# EasyEDA Pro project ProPrj_主板-智能视觉_2026-04-06.epro

# Schematic Schematic1
Board Name: Board1; Create Date: 2026-01-07; Page Name: P1; Project Name: 主板-智能视觉; Schematic Name: Schematic1; Update Date: 2026-03-23; Company: 嘉立创EDA; Page Size: A4; Version: V1.0
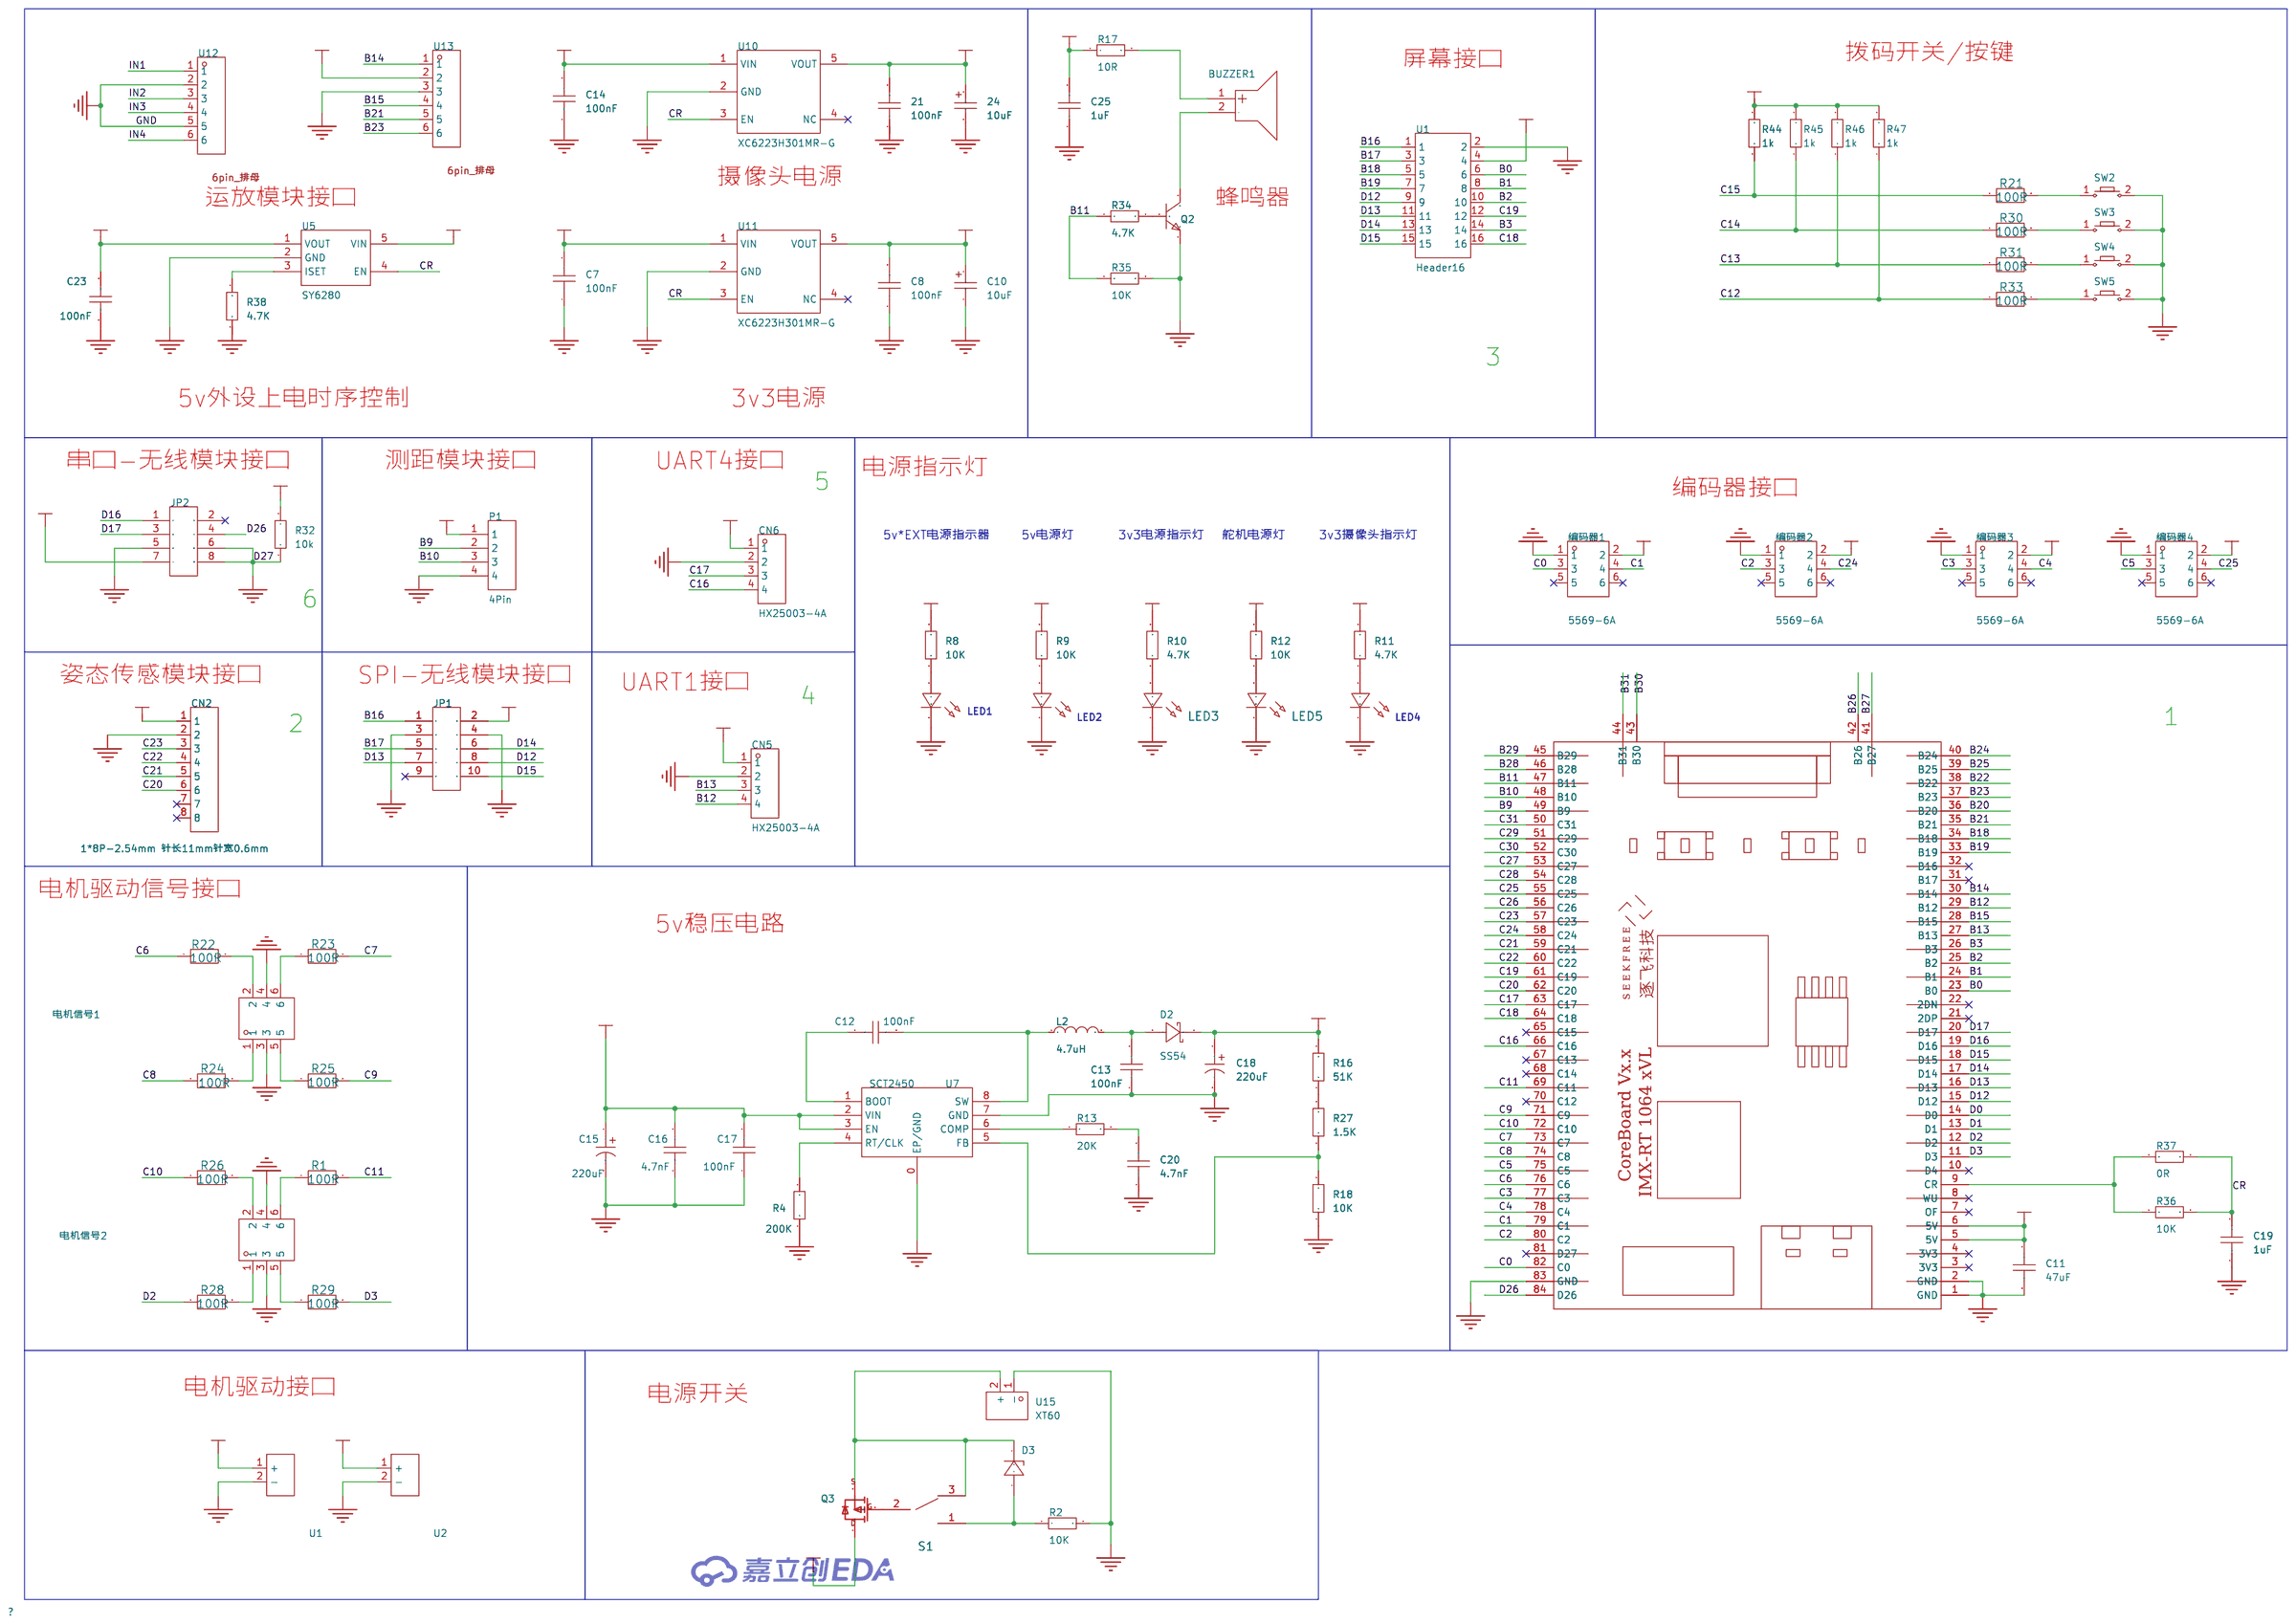
[diagram p0: schematic sheet]

## Parts
21  100nF  [C0603]
24  10uF  [CAP-SMD_L3.2-W1.6-RD-C7171]
BUZZER1  5V,管脚间距8mm,外径10mm,高9.5mm  [BUZ-TH_BD12.0-P7.60-D0.6-FD]
C7  100nF  [C0603]
C8  100nF  [C0603]
C10  10uF  [CAP-SMD_L3.2-W1.6-RD-C7171]
C11  47uF  [C0603]
C12  100nF  [C0603]
C13  100nF  [C1206]
C14  100nF  [C0603]
C15  220uF  [CAP-SMD_BD8.0-L8.3-W8.3-LS9.0-FD]
C16  4.7nF  [C1206]
C17  100nF  [C0603]
C18  220uF  [CAP-SMD_BD8.0-L8.3-W8.3-LS9.0-FD]
C19  1uF  [C0603]
C20  4.7nF  [C0603]
C23  100nF  [C0603]
C25  1uF  [C0603]
CN2  1*8P-2.54mm 针长11mm针宽0.6mm  [HDR-TH_8P-P2.54-V-F-S2.54]
CN5  HX25003-4A  [CONN-TH_4P-P2.50_HX25003-4A]
CN6  HX25003-4A  [CONN-TH_4P-P2.50_HX25003-4A]
D2  SS54  [SMA_L4.2-W2.6-LS5.1-RD]
D3  BZT52C16  [SOD-123-L]
JP1  2.54排母双排2*5P  [HDR2.54-LI-2x5P]
JP2  2.54排母双排2*4P  [HDR2.54-LI-2x4P]
L2  4.7uH  [IND-SMD_L7.1-W6.6_POHS0603]
LED1  -  [LED_0603]
LED2  -  [LED_0603]
LED3  -  [LED_0603]
LED4  -  [LED_0603]
LED5  -  [LED_0603]
P1  4Pin  [4Pin-2.54]
Q2  -  [S8050_TO_92]
Q3  HY19P03  [TO-252AA]
R1  100R  [R0603]
R2  10K  [R0603]
R4  200K  [R0603]
R8  10K  [R0603]
R9  10K  [R0603]
R10  4.7K  [R0603]
R11  4.7K  [R0603]
R12  10K  [R0603]
R13  20K  [R0603]
R16  51K  [R0603]
R17  10R  [R0603]
R18  10K  [R0603]
R21  100R  [R0603]
R22  100R  [R0603]
R23  100R  [R0603]
R24  100R  [R0603]
R25  100R  [R0603]
R26  100R  [R0603]
R27  1.5K  [R0603]
R28  100R  [R0603]
R29  100R  [R0603]
R30  100R  [R0603]
R31  100R  [R0603]
R32  10k  [R0603]
R33  100R  [R0603]
R34  4.7K  [R0603]
R35  10K  [R0603]
R36  10K  [R0603]
R37  0R  [R0603]
R38  4.7K  [R0603]
R44  1k  [R0603]
R45  1k  [R0603]
R46  1k  [R0603]
R47  1k  [R0603]
S1  SW-SPDT  [SS12D10]
SW2  -  [Key_SMD_3x4x2]
SW3  -  [Key_SMD_3x4x2]
SW4  -  [Key_SMD_3x4x2]
SW5  -  [Key_SMD_3x4x2]
U1  Header16  [CONN-TH_16P-P2.50_C9900044747]
U1#2  -  [XT30]
U2  -  [XT30]
U5  SY6280  [SOT-23-5]
U7  SCT2450  [SOP-8E]
U10  XC6223H301MR-G  [SOT_235]
U11  XC6223H301MR-G  [SOT_235]
U12  -  [6pin_排针]
U13  -  [6pin_排针]
U15  XT60  [CONN-TH_XT60]
U?1  -  [AUFE_RT1064]
电机信号1  5569-6A  [CONN-TH_6P-P4.20_5569-6A-1]
电机信号2  5569-6A  [CONN-TH_6P-P4.20_5569-6A-1]
编码器1  5569-6A  [CONN-TH_6P-P4.20_5569-6A-1]
编码器2  5569-6A  [CONN-TH_6P-P4.20_5569-6A-1]
编码器3  5569-6A  [CONN-TH_6P-P4.20_5569-6A-1]
编码器4  5569-6A  [CONN-TH_6P-P4.20_5569-6A-1]

## Library data of the parts
21 C7 C8 C11 C12 C14 C17 C19 C20 C23 C25 = CAP_0603: Supplier Footprint: 0603
24 C10 = TAJA106K016RNJ: 容值:10uF;精度:±10%;额定电压:16V;等效串联电阻(ESR):3Ω@100kHz;; LCSC Part Name: 10uF ±10% 16V; Supplier Part: C7171; Manufacturer: Kyocera AVX; Supplier Footprint: CASE-A-3216-18(mm); JLCPCB Part Class: 基础库; Supplier: LCSC; Tolerance: ±10%; Voltage Rating: 16V; Equivalent Series Resistance(ESR): 3Ω@100kHz; Operating Temperature: -55℃~+125℃
BUZZER1 = 5V,管脚间距8mm,外径10mm,高9.5mm: Supplier Part: C9900017013; Supplier Footprint: BEEP; JLCPCB Part Class: 扩展库; Supplier: LCSC
C13 C16 = CAP_1206: Supplier Footprint: 1206
C15 C18 = RYRVT25V220UF8*10: 容值:220uF;精度:±20%;额定电压:25V;纹波电流:183mA@120Hz;; LCSC Part Name: 220uF ±20% 25V; Supplier Part: C48970746; Manufacturer: HONOR(荣誉); Supplier Footprint: SMD,D8xL10.2mm; JLCPCB Part Class: 扩展库; Datasheet: https://item.szlcsc.com/datasheet/RYRVT25V220UF8*10/51295690.html; Supplier: LCSC; Tolerance: ±20%; Voltage Rating: 25V; Ripple Current: 183mA@120Hz; Diameter: 8mm; Height - Seated (Max): 10.2mm; Lifetime: 2000hrs@105℃; Operating Temperature: -55℃~+105℃
CN2 = 1*8P-2.54mm 针长11mm针宽0.6mm: Supplier Part: C9900024110; Supplier Footprint: 1*8P-2.54mm; JLCPCB Part Class: 扩展库; Supplier: LCSC
CN5 CN6 = HX25003-4A: 参考系列:XH;间距:2.5mm;插针结构:1x4P;排数:1;每排PIN数:4;行距:-;公母:公型插针;安装方式:直插;额定电流:-;工作温度范围:-;; LCSC Part Name: 母座 直插/直针 2.5mm 4Pin位; Supplier Part: C442301; Manufacturer: HX(红星); Supplier Footprint: 插件,P=2.5mm; JLCPCB Part Class: Extended Part; Datasheet: https://atta.szlcsc.com/upload/public/pdf/source/20191028/C442301_3A3D3A554E5F0CBC5D03B496CD495BC6.pdf; Supplier: LCSC; Reference Series: XH; Pitch: 2.5mm; Pins Structure: 1x4P; Number of Rows: 1; Number of PINs Per Row: 4; Gender: 公型插针; Mounting Style: 直插
D2 = SS54: Supplier Part: C9900023219; Supplier Footprint: (1N5824)DO-214; JLCPCB Part Class: 扩展库; Supplier: LCSC
D3 = BZT52C16: Published: 8-Jun-2000; Revision: July-2002: Re-released for DXP Platform.; Publisher: Altium Limited; Price(RMB): 0.000; Origin Footprint 2: DIODE-0.7; Origin Footprint 3: DIODE-0.4; Origin Footprint 4: SOD-87[LL-41]; Origin Footprint 5: CD4521-1808; Origin Footprint 6: SOD-80[LL-34]; Origin Footprint 7: SOD-123-FL; Origin Footprint 8: SOD-123-M; Origin Footprint 9: SOD-323; Origin Footprint 10: SOD-523-L; Origin Footprint 11: SOD-523-M
JP1 = 2.54排母双排2*5P
JP2 = 2.54排母双排2*4P
L2 = POHS0603-4R7M: 电感值:4.7uH;精度:±20%;额定电流:5A;饱和电流(Isat):8A;类型:一体成型电感;; LCSC Part Name: 功率电感; Supplier Part: C49333010; Manufacturer: HYHONGYEX(宏业); Supplier Footprint: SMD,7.1x6.6mm; JLCPCB Part Class: 扩展库; Datasheet: https://item.szlcsc.com/datasheet/POHS0603-4R7M/51817416.html; Supplier: LCSC; Tolerance: ±20%; Current Rating: 5A; Current - Saturation(Isat): 8A; DC Resistance(DCR): 40mΩ; Type: 一体成型电感
LED1 LED4 = LED_0603-G: Supplier Footprint: 0603
LED2 = LED_0603-B: Supplier Footprint: 0603
LED3 LED5 = LED_0603-R: Supplier Footprint: 0603
P1 = 4Pin
Q2 = S8050_TO_NPN: Supplier Footprint: TO-92
Q3 = HY19P03: HY19P03 P-Channel MOSFET; componentDisplayMode: -1
R1 R21-R26 R28-R31 R33 = 100R
R2 R4 R8-R13 R16-R18 R27 R34-R38 = Res_0603: Supplier Footprint: 0603
R32 R44-R47 = R-10K-1%: 电阻类型:厚膜电阻;阻值:10kΩ;精度:±1%;功率:100mW;工作电压:75V;温度系数:±100ppm/℃;; Manufacturer: UNI-ROYAL(厚声); Manufacturer Part: 0603WAF1002T5E; Supplier: LCSC; Supplier Part: C25804; LCSC Part Name: 厚膜电阻 10kΩ ±1% 100mW; Supplier Footprint: 0603; JLCPCB Part Class: Basic Part; Datasheet: https://atta.szlcsc.com/upload/public/pdf/source/20200306/C422600_1E6D84923E4A46A82E41ADD87F860B5C.pdf; Type: 厚膜电阻; Tolerance: ±1%; Power(Watts): 100mW; Voltage-Supply(Max): 75V; Temperature Coefficient: ±100ppm/℃; Operating Temperature: -55℃~+155℃
S1 = SW-SPDT: Published: 24-Mar-1999; Publisher: Altium Limited; Price(RMB): 0.000
SW2-SW5 = Key_SMD_3x4x2: Supplier Footprint: SMD
U1 = Header16_C9900044747: Supplier Part: C9900044747; Supplier Footprint: TH-2*8P-2.54; JLCPCB Part Class: 扩展库; Supplier: LCSC
U1#2 U2 = XT30
U5 = SY6280: Published: 2020-12-08; Revision: V1.0; Imax: 2.1A
U7 = SCT2450
U10 U11 = XC6223H301MR-G: 存货编码: 1110404156; 存货名称: 集成电路
U12 U13 = 6pin_排母
U15 = XT60: 模型锂电连接器; LCSC Part Name: XT60公头（电调端）; Supplier Part: C98733; Manufacturer: AMASS(艾迈斯); Supplier Footprint: XT60-M; JLCPCB Part Class: 扩展库; Datasheet: https://atta.szlcsc.com/upload/public/pdf/source/20170606/1496716524919.pdf; Supplier: LCSC
U?1 = RT1064: Supplier: seekfree
电机信号1 电机信号2 编码器1-编码器4 = 5569-6A: Supplier Part: C9900070523; Supplier Footprint: 2*3p; JLCPCB Part Class: Extended Part; Supplier: LCSC

## Nets
3V3: 21.2 24.1 C8.2 C10.1 C25.2 CN2.1 P1.1 R10.2 R17.1 R32.2 R44.2 R45.2 R46.2 R47.2 U1.4 U10.5(VOUT) U11.5(VOUT) U13.2 编码器1.2 编码器2.2 编码器3.2 编码器4.2
GND: 21.1 24.2 C7.1 C8.1 C10.2 C11.2 C13.1 C14.1 C15.2 C16.1 C17.1 C18.2 C19.1 C20.1 C23.1 C25.1 CN2.2 CN5.2 CN6.2 JP1.3 JP1.4 JP2.5 JP2.6 LED1.1(C) LED2.1(C) LED3.1(C) LED4.1(C) LED5.1(C) P1.4 Q2.1(E) R2.2 R4.1 R18.1 R35.2 R38.1 SW2.2 SW3.2 SW4.2 SW5.2 U1.2 U1#2.2(-) U2.2(-) U5.2(GND) U7.0(EP/GND) U7.7(GND) U10.2(GND) U11.2(GND) U12.2 U12.5 U13.3 U15.1(-) U?1.1(GND) U?1.2(GND) U?1.83(GND) 电机信号1.3 电机信号1.4 电机信号2.3 电机信号2.4 编码器1.1 编码器2.1 编码器3.1 编码器4.1
VCC-5V: C11.1 C18.1 D2.1(C) R9.2 R16.2 U5.5(VIN) U?1.5(5V) U?1.6(5V)
VCC-5V-EXT: C23.2 CN5.1 CN6.1 JP1.2 JP2.7 R8.2 U5.1(VOUT)
VCC_5V: C7.2 C14.2 U10.1(VIN) U11.1(VIN)
VCC_SERVO: R12.2
VCCBAT: C15.1 C16.2 C17.2 Q3.1(D) U1#2.1(+) U2.1(+) U7.2(VIN) U7.3(EN)
B0: U1.6 U?1.23(B0)
B1: U1.8 U?1.24(B1)
B2: U1.10 U?1.25(B2)
B3: U1.14 U?1.26(B3)
B9: P1.2 U?1.49(B9)
B10: P1.3 U?1.48(B10)
B11: R34.1 R35.1 U?1.47(B11)
B12: CN5.4 U?1.29(B12)
B13: CN5.3 U?1.27(B13)
B14: U13.1 U?1.30(B14)
B15: U13.4 U?1.28(B15)
B16: JP1.1 U1.1
B17: JP1.5 U1.3
B18: U1.5 U?1.34(B18)
B19: U1.7 U?1.33(B19)
B20: U?1.36(B20)
B21: U13.5 U?1.35(B21)
B22: U?1.38(B22)
B23: U13.6 U?1.37(B23)
B24: U?1.40(B24)
B25: U?1.39(B25)
B26: U?1.42(B26)
B27: U?1.41(B27)
B28: U?1.46(B28)
B29: U?1.45(B29)
B30: U?1.43(B30)
B31: U?1.44(B31)
C0: U?1.82(C0) 编码器1.3
C1: U?1.79(C1) 编码器1.4
C2: U?1.80(C2) 编码器2.3
C3: U?1.77(C3) 编码器3.3
C4: U?1.78(C4) 编码器3.4
C5: U?1.75(C5) 编码器4.3
C6: R22.1 U?1.76(C6)
C7: R23.2 U?1.73(C7)
C8: R24.1 U?1.74(C8)
C9: R25.2 U?1.71(C9)
C10: R26.1 U?1.72(C10)
C11: R1.2 U?1.69(C11)
C12: R33.1 R47.1
C13: R31.1 R46.1
C14: R30.1 R45.1
C15: R21.1 R44.1
C16: CN6.4 U?1.66(C16)
C17: CN6.3 U?1.63(C17)
C18: U1.16 U?1.64(C18)
C19: U1.12 U?1.61(C19)
C20: CN2.6 U?1.62(C20)
C21: CN2.5 U?1.59(C21)
C22: CN2.4 U?1.60(C22)
C23: CN2.3 U?1.57(C23)
C24: U?1.58(C24) 编码器2.4
C25: U?1.55(C25) 编码器4.4
C26: U?1.56(C26)
C27: U?1.53(C27)
C28: U?1.54(C28)
C29: U?1.51(C29)
C30: U?1.52(C30)
C31: U?1.50(C31)
CR: C19.2 R36.2 R37.2 U5.4(EN) U10.3(EN) U11.3(EN)
CSI-3V3: R11.2
D0: U?1.14(D0)
D1: U?1.13(D1)
D2: R28.1 U?1.12(D2)
D3: R29.2 U?1.11(D3)
D12: JP1.8 U1.9 U?1.15(D12)
D13: JP1.7 U1.11 U?1.16(D13)
D14: JP1.6 U1.13 U?1.17(D14)
D15: JP1.10 U1.15 U?1.18(D15)
D16: JP2.1 U?1.19(D16)
D17: JP2.3 U?1.20(D17)
D26: JP2.4 U?1.84(D26)
D27: JP2.8 R32.1
IN1: U12.1
IN2: U12.3
IN3: U12.4
IN4: U12.6
$1N2592: R24.2 电机信号1.1
$1N2596: R25.1 电机信号1.5
$1N2604: R22.2 电机信号1.2
$1N2608: R23.1 电机信号1.6
$1N2916: R28.2 电机信号2.1
$1N2919: R29.1 电机信号2.5
$1N2922: R26.2 电机信号2.2
$1N2925: R1.1 电机信号2.6
$1N3992: R21.2 SW2.1
$1N3996: R30.2 SW3.1
$1N4004: R31.2 SW4.1
$1N4009: R33.2 SW5.1
$1N4528: LED3.2(A) R10.1
$1N4650: LED4.2(A) R11.1
$1N4783: LED1.2(A) R8.1
$1N4874: LED5.2(A) R12.1
$1N5051: LED2.2(A) R9.1
$1N8072: R38.2 U5.3(ISET)
$1N10416: R4.2 U7.4(RT/CLK)
$1N10423: C12.1 U7.1(BOOT)
$1N10427: C12.2 L2.1 U7.8(SW)
$1N10446: C20.2 R13.2
$1N10453: R18.2 R27.1 U7.5(FB)
$1N10461: R13.1 U7.6(COMP)
$1N10501: R16.1 R27.2
$1N10556: C13.2 D2.2(A) L2.2
$1N13494: BUZZER1.1(+) R17.2
$1N13753: Q2.2(B) R34.2
$1N13767: BUZZER1.2(-) Q2.3(C)
$1N14471: D3.K Q3.3(S) S1.3 U15.2(+)
$1N14655: D3.A R2.1 S1.1
$1N20848: R36.1 R37.1 U?1.9(CR)
$1N26305: Q3.2(G) S1.2

Not connected (* = marked no-connect by the designer): CN2 7* 8*; JP1 9*; JP2 2*; U10 4(NC)*; U11 4(NC)*; U?1 3(3V3)* 4(3V3)* 7(OF)* 8(WU)* 10(D4)* 21(2DP)* 22(2DN)* 31(B17)* 32(B16)* 65(C15)* 67(C13)* 68(C14)* 70(C12)* 81(D27)*; 编码器1 5* 6*; 编码器2 5* 6*; 编码器3 5* 6*; 编码器4 5* 6*

## Notes on the sheet
- 拨码开关/按键
- 屏幕接口
- 摄像头电源
- 运放模块接口
- 蜂鸣器
- 3
- 5v外设上电时序控制
- 3v3电源
- 串口-无线模块接口
- 测距模块接口
- UART4接口
- 电源指示灯
- 5
- 编码器接口
- 5v*EXT电源指示器
- 5v电源灯
- 3v3电源指示灯
- 舵机电源灯
- 3v3摄像头指示灯
- 6
- 姿态传感模块接口
- SPI-无线模块接口
- UART1接口
- 4
- 2
- 1
- 电机驱动信号接口
- 5v稳压电路
- 电机驱动接口
- 电源开关

# Board PCB1
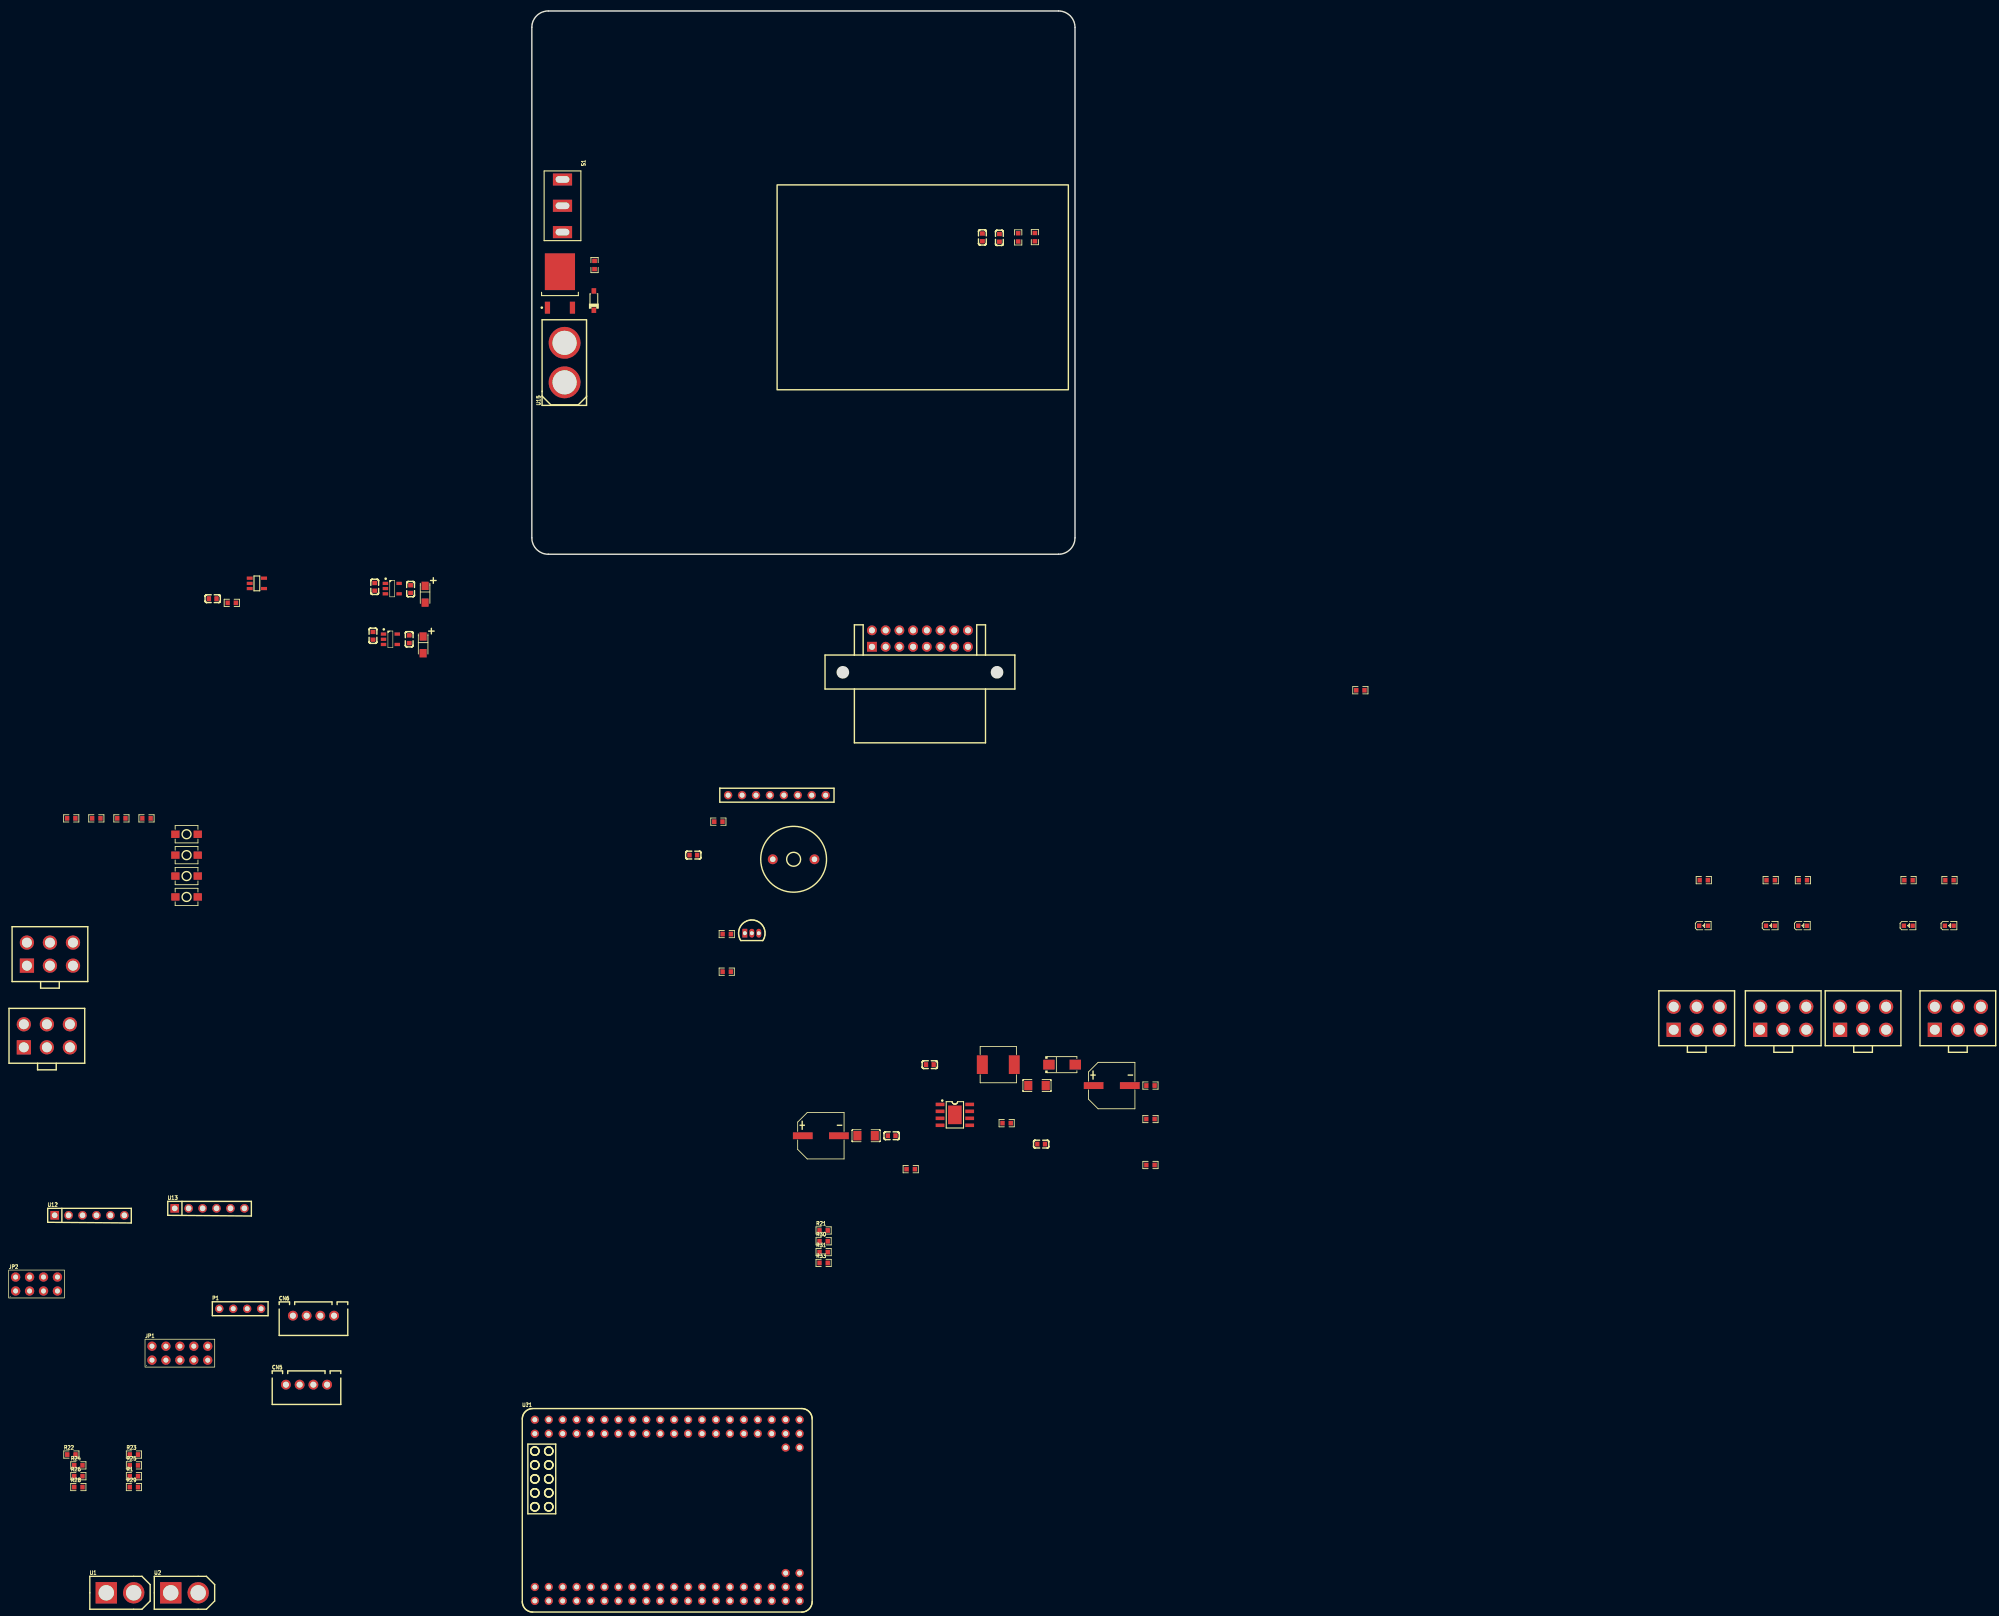
[diagram p1: board, top side]
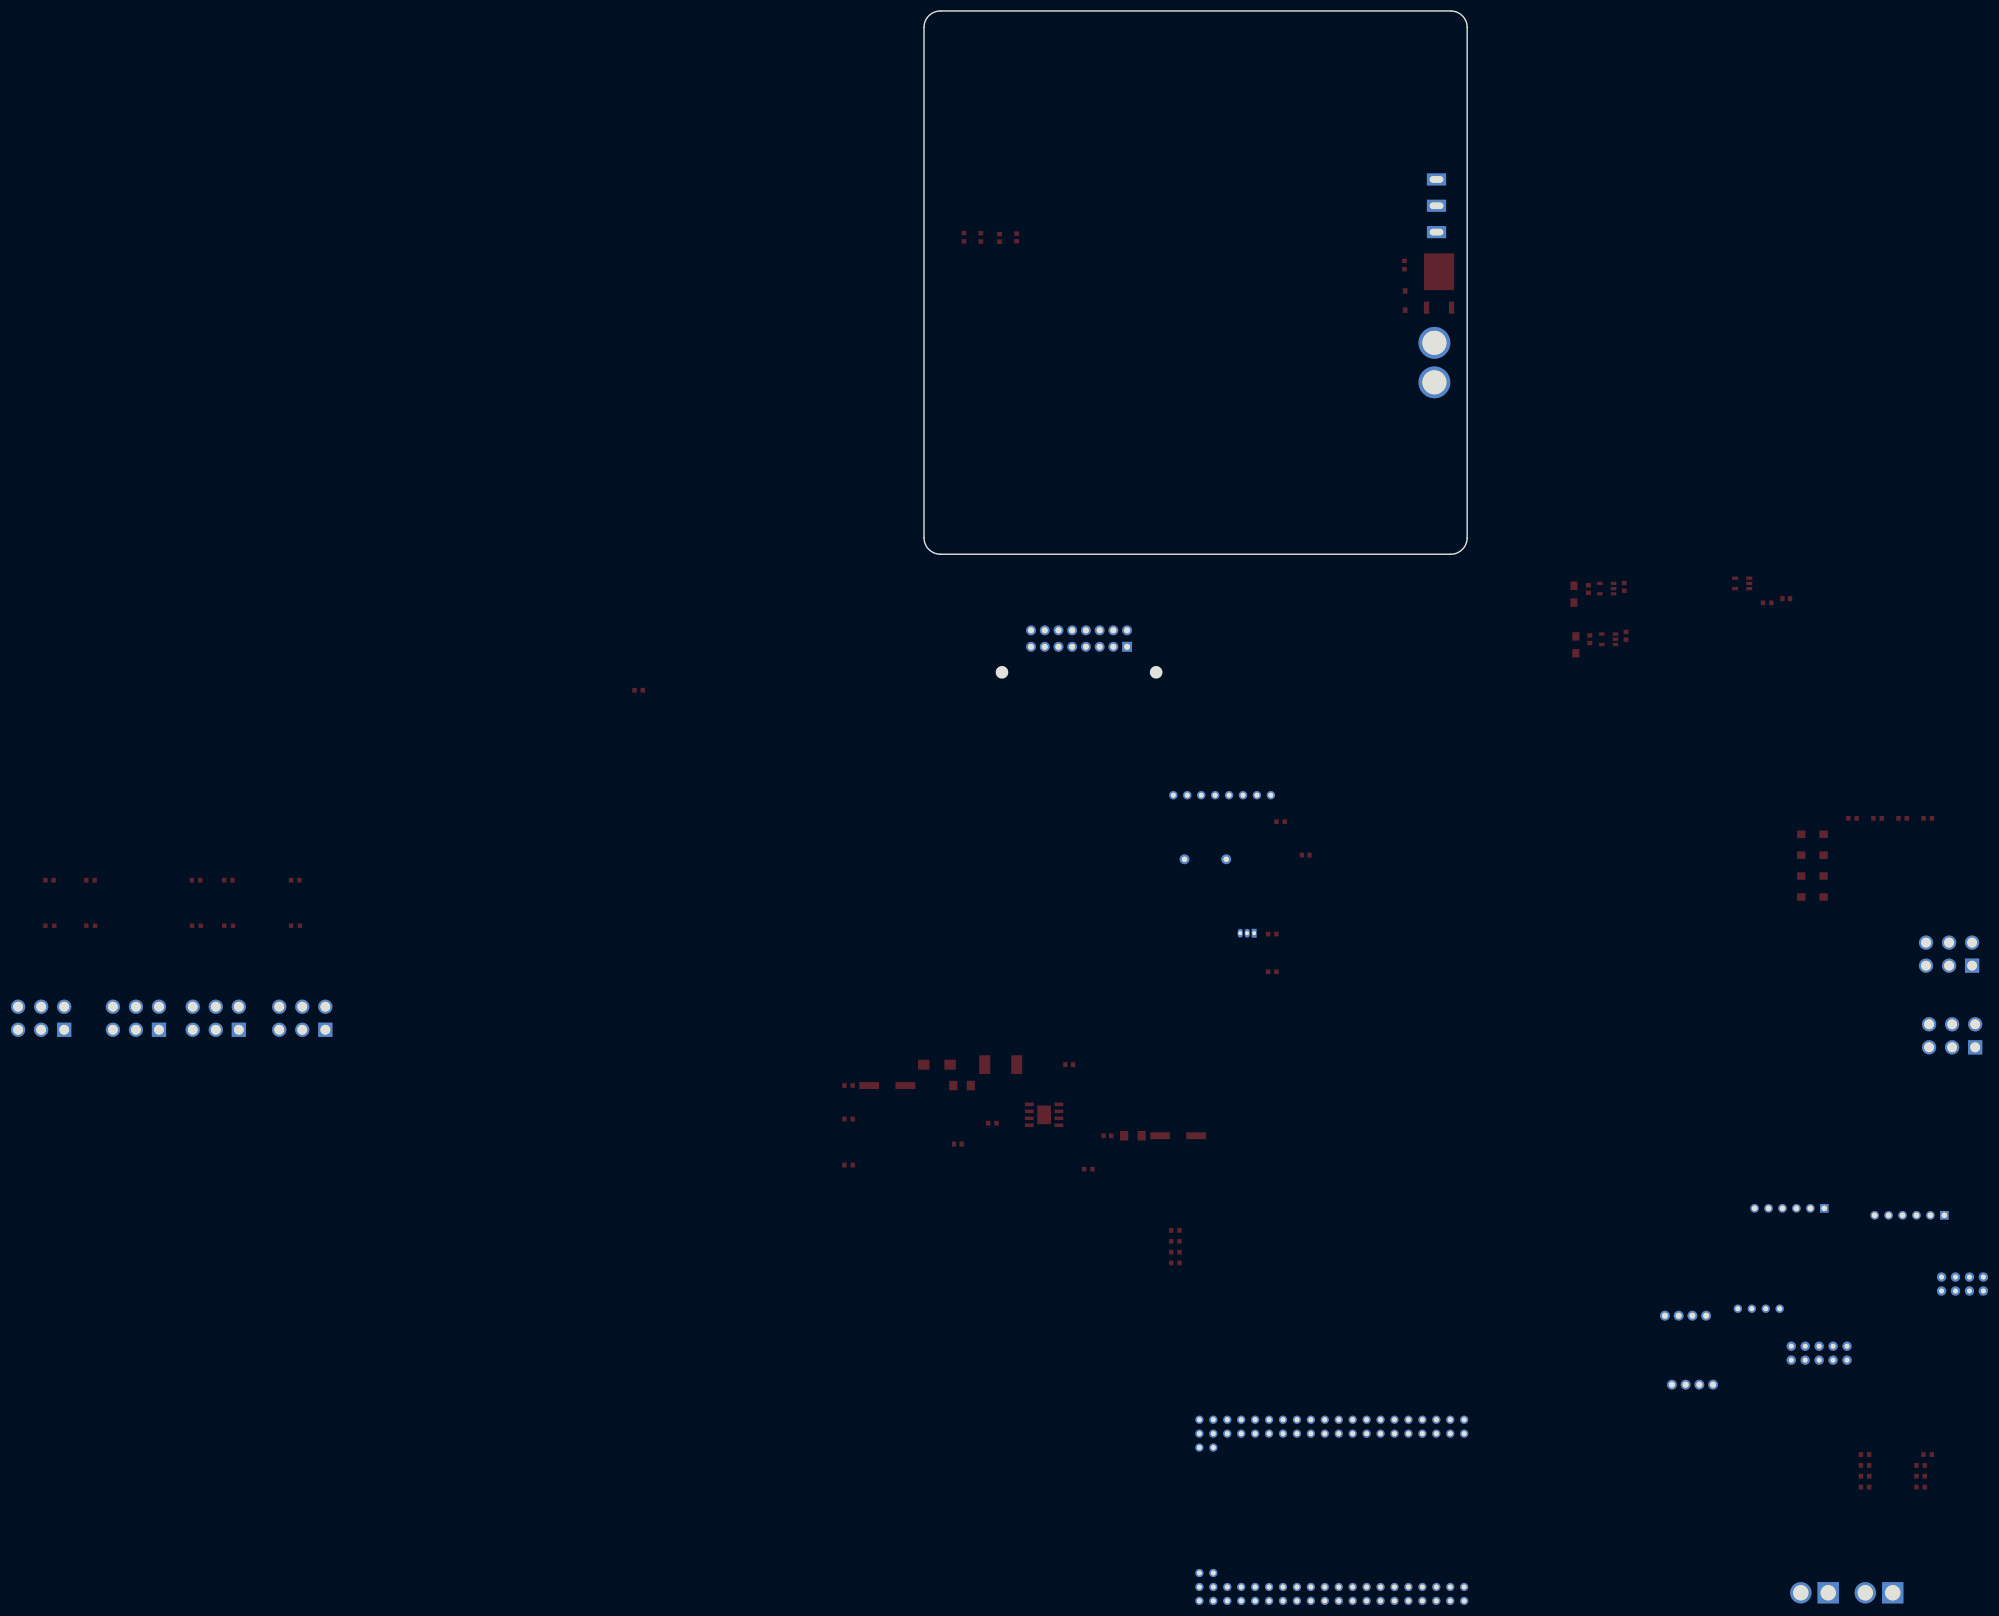
[diagram p2: board, bottom side, seen from below]

Outline 99 x 121.66 mm; copper layers: Top Layer, Bottom Layer. Coordinates in mm from the lower left corner of the outline.
Outline path: 0,118.66 0,25.66 arc(0.88,23.54) 3,22.66 96,22.66 arc(98.12,23.54) 99,25.66 99,118.66 arc(98.12,120.78) 96,121.66 3,121.66 arc(0.88,120.78) 0,118.66
Stack: Top Layer 0.035mm / Dielectric1 1.51mm FR4 er 4.5 / Bottom Layer 0.035mm

## Design rules (mm)
template: JLCPCB Capability(Two Layers Board)
spacing copperThickness1oz (default): track to track 0.102, other pairs 0.152 to 0.3
spacing copperThickness2oz: track to track 0.203, other pairs 0.152 to 0.3
track width copperThickness1oz (default): min 0.127, default 0.254, max 2.54
track width copperThickness2oz: min 0.203, default 0.254, max 2.54
differential pair differentialPair (default): width min 0.127, default 0.254, max 2.54; gap min 0.152, default 0.152
via viaSize (default): diameter min 0.5, default 0.61, max 10; hole min 0.3, default 0.305, max 6.3

## Placement (name value [footprint] x y rotation side)
21  100nF  [C0603]  -22.1 16.31 90 top
24  10uF  [CAP-SMD_L3.2-W1.6-RD-C7171]  -19.46 15.38 270 top
BUZZER1  5V,管脚间距8mm,外径10mm,高9.5mm  [BUZ-TH_BD12.0-P7.60-D0.6-FD]  47.71 -32.92 0 top
C7  100nF  [C0603]  -28.96 7.8 90 top
C8  100nF  [C0603]  -22.35 7.17 90 top
C10  10uF  [CAP-SMD_L3.2-W1.6-RD-C7171]  -19.81 6.15 270 top
C11  47uF  [C0603]  82.12 80.4 270 top
C12  100nF  [C0603]  72.53 -70.35 0 top
C13  100nF  [C1206]  92.07 -74.16 0 top
C14  100nF  [C0603]  -28.64 16.72 90 top
C15  220uF  [CAP-SMD_BD8.0-L8.3-W8.3-LS9.0-FD]  52.68 -83.31 0 top
C16  4.7nF  [C1206]  60.92 -83.31 0 top
C17  100nF  [C0603]  65.58 -83.31 0 top
C18  220uF  [CAP-SMD_BD8.0-L8.3-W8.3-LS9.0-FD]  105.69 -74.16 0 top
C19  1uF  [C0603]  85.22 80.32 270 top
C20  4.7nF  [C0603]  92.83 -84.83 0 top
C23  100nF  [C0603]  -58.17 14.56 0 top
C25  1uF  [C0603]  29.43 -32.16 0 top
CN2  1*8P-2.54mm 针长11mm针宽0.6mm  [HDR-TH_8P-P2.54-V-F-S2.54]  44.67 -21.25 0 top
CN5  HX25003-4A  [CONN-TH_4P-P2.50_HX25003-4A]  -41.07 -128.67 0 top
CN6  HX25003-4A  [CONN-TH_4P-P2.50_HX25003-4A]  -39.8 -116.1 0 top
D2  SS54  [SMA_L4.2-W2.6-LS5.1-RD]  96.64 -70.35 0 top
D3  BZT52C16  [SOD-123-L]  11.3 68.89 270 top
JP1  2.54排母双排2*5P  [HDR2.54-LI-2x5P]  -64.15 -122.93 0 top
JP2  2.54排母双排2*4P  [HDR2.54-LI-2x4P]  -90.28 -110.33 0 top
L2  4.7uH  [IND-SMD_L7.1-W6.6_POHS0603]  85.02 -70.35 0 top
LED1  -  [LED_0603]  225.8 -45.03 0 top
LED2  -  [LED_0603]  231.67 -45.03 0 top
LED3  -  [LED_0603]  250.93 -45.03 0 top
LED4  -  [LED_0603]  258.39 -45.03 0 top
LED5  -  [LED_0603]  213.61 -45.03 0 top
P1  4Pin  [4Pin-2.54]  -53.15 -114.83 0 top
Q2  -  [S8050_TO_92]  40.09 -46.4 0 top
Q3  HY19P03  [TO-252AA]  5.12 70.87 90 top
R1  100R  [R0603]  -72.53 -145.35 0 top
R2  10K  [R0603]  11.43 75.37 90 top
R4  200K  [R0603]  69.06 -89.4 0 top
R8  10K  [R0603]  225.8 -36.73 0 top
R9  10K  [R0603]  231.67 -36.73 0 top
R10  4.7K  [R0603]  250.93 -36.73 0 top
R11  4.7K  [R0603]  258.39 -36.73 0 top
R12  10K  [R0603]  213.61 -36.73 0 top
R13  20K  [R0603]  86.54 -81.02 0 top
R16  51K  [R0603]  112.76 -74.16 0 top
R17  10R  [R0603]  34 -26.07 0 top
R18  10K  [R0603]  112.76 -88.64 0 top
R21  100R  [R0603]  53.18 -100.57 0 top
R22  100R  [R0603]  -83.93 -141.4 0 top
R23  100R  [R0603]  -72.53 -141.4 0 top
R24  100R  [R0603]  -82.66 -143.38 0 top
R25  100R  [R0603]  -72.53 -143.38 0 top
R26  100R  [R0603]  -82.66 -145.35 0 top
R27  1.5K  [R0603]  112.76 -80.26 0 top
R28  100R  [R0603]  -82.66 -147.33 0 top
R29  100R  [R0603]  -72.53 -147.33 0 top
R30  100R  [R0603]  53.18 -102.54 0 top
R31  100R  [R0603]  53.18 -104.51 0 top
R32  10k  [R0603]  151.02 -2.12 0 top
R33  100R  [R0603]  53.18 -106.49 0 top
R34  4.7K  [R0603]  35.52 -46.55 0 top
R35  10K  [R0603]  35.52 -53.41 0 top
R36  10K  [R0603]  88.65 80.4 270 top
R37  0R  [R0603]  91.69 80.45 270 top
R38  4.7K  [R0603]  -54.69 13.8 0 top
R44  1k  [R0603]  -83.95 -25.47 0 top
R45  1k  [R0603]  -79.38 -25.47 0 top
R46  1k  [R0603]  -74.81 -25.47 0 top
R47  1k  [R0603]  -70.23 -25.47 0 top
S1  SW-SPDT  [SS12D10]  5.59 86.16 270 top
SW2  -  [Key_SMD_3x4x2]  -62.93 -28.36 0 top
SW3  -  [Key_SMD_3x4x2]  -62.93 -32.17 0 top
SW4  -  [Key_SMD_3x4x2]  -62.93 -35.98 0 top
SW5  -  [Key_SMD_3x4x2]  -62.93 -39.79 0 top
U1  Header16  [XT30]  -75.07 -166.6 0 top
U1#2  -  [CONN-TH_16P-P2.50_C9900044747]  70.74 7.3 0 top
U2  -  [XT30]  -63.31 -166.6 0 top
U5  SY6280  [SOT-23-5]  -50.12 17.35 0 top
U7  SCT2450  [SOP-8E]  77.11 -79.5 0 top
U10  XC6223H301MR-G  [SOT_235]  -25.44 16.4 0 top
U11  XC6223H301MR-G  [SOT_235]  -25.78 7.17 0 top
U12  -  [6pin_排针]  -80.12 -97.55 0 top
U13  -  [6pin_排针]  -58.23 -96.28 0 top
U15  XT60  [CONN-TH_XT60]  5.97 57.59 90 top
U?1  -  [AUFE_RT1064]  24.68 -151.56 0 top
电机信号1  5569-6A  [CONN-TH_6P-P4.20_5569-6A-1]  -87.83 -50.21 0 top
电机信号2  5569-6A  [CONN-TH_6P-P4.20_5569-6A-1]  -88.39 -65.09 0 top
编码器1  5569-6A  [CONN-TH_6P-P4.20_5569-6A-1]  212.32 -61.9 0 top
编码器2  5569-6A  [CONN-TH_6P-P4.20_5569-6A-1]  228.08 -61.9 0 top
编码器3  5569-6A  [CONN-TH_6P-P4.20_5569-6A-1]  242.64 -61.9 0 top
编码器4  5569-6A  [CONN-TH_6P-P4.20_5569-6A-1]  259.91 -61.9 0 top

## Footprints (pads in the part's own frame, mm; a bottom-side part is the same pattern mirrored in y, then rotated)
4Pin-2.54
  round 1.524 hole 0.9: 1(-3.81,0) 2(-1.27,0) 3(1.27,0) 4(3.81,0)
6pin_排针
  rect 1.575x1.575 hole 1.02: 1(-6.858,-0.254)
  round 1.575 hole 1.02: 2(-4.318,-0.254) 3(-1.778,-0.254) 4(0.762,-0.254) 5(3.302,-0.254) 6(5.842,-0.254)
AUFE_RT1064
  round 1.5 hole 0.9: 1(-24.13,-16.51) 2(-24.13,-13.97) 3(-21.59,-16.51) 4(-21.59,-13.97) 5(-19.05,-16.51) 6(-19.05,-13.97) 7(-16.51,-16.51) 8(-16.51,-13.97) 9(-13.97,-16.51) 10(-13.97,-13.97) 11(-11.43,-16.51) 12(-11.43,-13.97) 13(-8.89,-16.51) 14(-8.89,-13.97) 15(-6.35,-16.51) 16(-6.35,-13.97) 17(-3.81,-16.51) 18(-3.81,-13.97) 19(-1.27,-16.51) 20(-1.27,-13.97) 21(1.27,-16.51) 22(1.27,-13.97) 23(3.81,-16.51) 24(3.81,-13.97) 25(6.35,-16.51) 26(6.35,-13.97) 27(8.89,-16.51) 28(8.89,-13.97) 29(11.43,-16.51) 30(11.43,-13.97) 31(13.97,-16.51) 32(13.97,-13.97) 33(16.51,-16.51) 34(16.51,-13.97) 35(19.05,-16.51) 36(19.05,-13.97) 37(21.59,-16.51) 38(21.59,-13.97) 39(24.13,-16.51) 40(24.13,-13.97) 41(21.59,-11.43) 42(24.13,-11.43) 43(24.13,11.43) 44(21.59,11.43) 45(24.13,13.97) 46(24.13,16.51) 47(21.59,13.97) 48(21.59,16.51) 49(19.05,13.97) 50(19.05,16.51) 51(16.51,13.97) 52(16.51,16.51) 53(13.97,13.97) 54(13.97,16.51) 55(11.43,13.97) 56(11.43,16.51) 57(8.89,13.97) 58(8.89,16.51) 59(6.35,13.97) 60(6.35,16.51) 61(3.81,13.97) 62(3.81,16.51) 63(1.27,13.97) 64(1.27,16.51) 65(-1.27,13.97) 66(-1.27,16.51) 67(-3.81,13.97) 68(-3.81,16.51) 69(-6.35,13.97) 70(-6.35,16.51) 71(-8.89,13.97) 72(-8.89,16.51) 73(-11.43,13.97) 74(-11.43,16.51) 75(-13.97,13.97) 76(-13.97,16.51) 77(-16.51,13.97) 78(-16.51,16.51) 79(-19.05,13.97) 80(-19.05,16.51) 81(-21.59,13.97) 82(-21.59,16.51) 83(-24.13,13.97) 84(-24.13,16.51)
BUZ-TH_BD12.0-P7.60-D0.6-FD
  round 1.8 hole 1: 1(-3.8,0) 2(3.8,0)
C0603
  rect 0.8x0.9 smd: 1(-0.7,0) 2(0.7,0)
C1206
  rect 1.485x1.728 smd: 1(-1.593,0) 2(1.593,0)
CAP-SMD_BD8.0-L8.3-W8.3-LS9.0-FD
  rect 3.61x1.26 smd: 1(-3.295,0) 2(3.295,0)
CAP-SMD_L3.2-W1.6-RD-C7171
  rect 1.53x1.296 smd: 1(-1.53,0) 2(1.53,0)
CONN-TH_4P-P2.50_HX25003-4A
  round 1.8 hole 1.1: 1(-3.75,0) 2(-1.25,0) 3(1.25,0) 4(3.75,0)
CONN-TH_6P-P4.20_5569-6A-1
  rect 2.6x2.6 hole 1.8: 1(-4.2,-2.1)
  round 2.6 hole 1.8: 2(-4.2,2.1) 3(0,-2.1) 4(0,2.1) 5(4.2,-2.1) 6(4.2,2.1)
CONN-TH_16P-P2.50_C9900044747
  rect 1.8x1.8 hole 1.1: 1(-8.75,-1.5)
  round 1.8 hole 1.1: 2(-8.75,1.5) 3(-6.25,-1.5) 4(-6.25,1.5) 5(-3.75,-1.5) 6(-3.75,1.5) 7(-1.25,-1.5) 8(-1.25,1.5) 9(1.25,-1.5) 10(1.25,1.5) 11(3.75,-1.5) 12(3.75,1.5) 13(6.25,-1.5) 14(6.25,1.5) 15(8.75,-1.5) 16(8.75,1.5)
CONN-TH_XT60
  round 5.8 hole 4.4: 1(-3.6,0) 2(3.6,0)
HDR2.54-LI-2x4P
  round 1.7 hole 0.9: 1(-3.81,-1.27) 2(-3.81,1.27) 3(-1.27,-1.27) 4(-1.27,1.27) 5(1.27,-1.27) 6(1.27,1.27) 7(3.81,-1.27) 8(3.81,1.27)
HDR2.54-LI-2x5P
  round 1.7 hole 0.9: 1(-5.08,-1.27) 2(-5.08,1.27) 3(-2.54,-1.27) 4(-2.54,1.27) 5(0,-1.27) 6(0,1.27) 7(2.54,-1.27) 8(2.54,1.27) 9(5.08,-1.27) 10(5.08,1.27)
HDR-TH_8P-P2.54-V-F-S2.54
  round 1.524 hole 0.914: 1(-8.89,0) 2(-6.35,0) 3(-3.81,0) 4(-1.27,0) 5(1.27,0) 6(3.81,0) 7(6.35,0) 8(8.89,0)
IND-SMD_L7.1-W6.6_POHS0603
  rect 2x3.4 smd: 1(-2.913,0) 2(2.913,0)
Key_SMD_3x4x2
  rect 1.53x1.36 smd: 1(-2.035,0) 2(2.035,0)
LED_0603
  rect 0.8x0.8 smd: 1(-0.851,-0.01) 2(0.75,-0.005)
R0603
  rect 0.806x0.864 smd: 1(-0.753,0) 2(0.753,0)
S8050_TO_92
  rect 0.899x1.6 hole 0.701: 1(-1.27,0)
  oval 0.899x1.6 hole 0.701: 2(0,0) 3(1.27,0)
SMA_L4.2-W2.6-LS5.1-RD
  rect 2.1x1.8 smd: 1(-2.4,0) 2(2.4,0)
SOD-123-L
  rect 1x0.85 smd: A(-1.75,0) K(1.75,0)
SOP-8E
  rect 2.5x3.4 smd: 0(0,0)
  rect 1.6x0.65 smd: 1(-2.7,1.905) 2(-2.7,0.635) 3(-2.7,-0.635) 4(-2.7,-1.905) 5(2.7,-1.905) 6(2.7,-0.635) 7(2.7,0.635) 8(2.7,1.905)
SOT-23-5
  rect 1.1x0.6 smd: 1(-1.3,0.95) 2(-1.3,0) 3(-1.3,-0.95) 4(1.3,-0.95) 5(1.3,0.95)
SOT_235
  rect 1x0.6 smd: 1(-1.25,0.95) 2(-1.25,0) 3(-1.25,-0.95) 4(1.25,-0.95) 5(1.25,0.95)
SS12D10
  rect 2.2x3.5 hole 1.2x2.5: 1(-4.8,0) 2(0,0) 3(4.8,0)
TO-252AA
  rect 6.7x5.5 smd: 1(3.275,0)
  rect 2.2x0.95 smd: 2(-3.275,2.28) 3(-3.275,-2.28)
XT30
  rect 3.9x3.9 hole 2.8: 1(-2.5,0)
  round 3.9 hole 2.8: 2(2.5,0)

## Nets
As in the schematic, except:
3V3: 21.2 24.1 C8.2 C10.1 C25.2 CN2.1 P1.1 R10.2 R17.1 R32.2 R44.2 R45.2 R46.2 R47.2 U1#2.4 U10.5 U11.5 U13.2 编码器1.2 编码器2.2 编码器3.2 编码器4.2
VCCBAT: C15.1 C16.2 C17.2 Q3.1 U1.1 U2.1 U7.2 U7.3
B0: U1#2.6 U?1.23
B1: U1#2.8 U?1.24
B2: U1#2.10 U?1.25
B3: U1#2.14 U?1.26
B16: JP1.1 U1#2.1
B17: JP1.5 U1#2.3
B18: U1#2.5 U?1.34
B19: U1#2.7 U?1.33
C18: U1#2.16 U?1.64
C19: U1#2.12 U?1.61
D12: JP1.8 U1#2.9 U?1.15
D13: JP1.7 U1#2.11 U?1.16
D14: JP1.6 U1#2.13 U?1.17
D15: JP1.10 U1#2.15 U?1.18

Pads without a net: CN2 7 8; JP1 9; JP2 2; U10 4; U11 4; U?1 3 4 7 8 10 21 22 31 32 65 67 68 70 81; 编码器1 5 6; 编码器2 5 6; 编码器3 5 6; 编码器4 5 6
